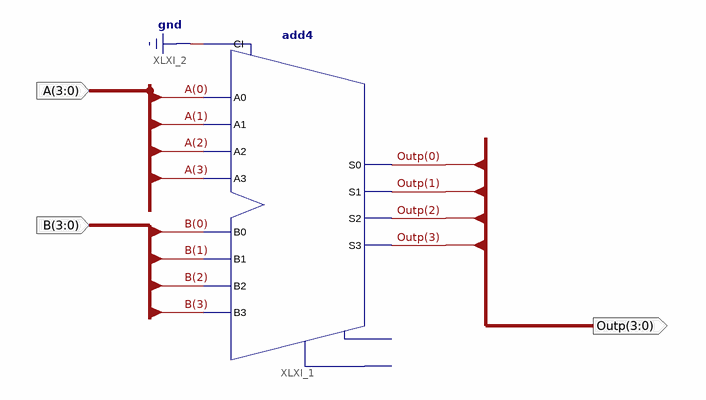
[diagram p0: schematic sheet 1]
// Xilinx ISE schematic add4_bus.sch (spartan3e) as structural Verilog: 1 symbols, 3 ports
module add4_bus (
  input  [3:0] A,
  input  [3:0] B,
  output [3:0] Outp
);

  add4 XLXI_1 (
    .A0(A[0]), .A1(A[1]), .A2(A[2]), .A3(A[3]), .B0(B[0]), .B1(B[1]), .B2(B[2]), .B3(B[3]), .CI(1'b0),
    .S0(Outp[0]), .S1(Outp[1]), .S2(Outp[2]), .S3(Outp[3]));  // open: CO, OFL
endmodule
